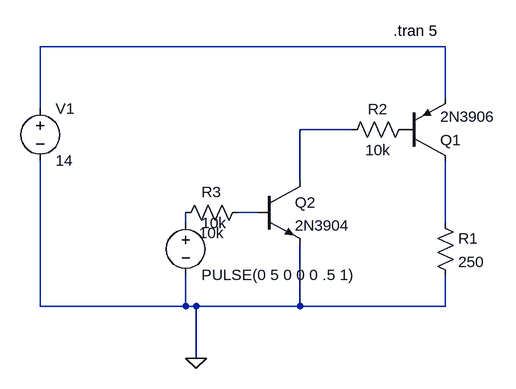
[diagram p0: schematic High side Switch 2BJT.asc]
High side Switch 2BJT.asc, the LTspice schematic file:
Version 4.1
SHEET 1 880 680
WIRE 288 64 -336 64
WIRE 288 144 288 64
WIRE -336 160 -336 64
WIRE 144 192 64 192
WIRE 64 272 64 192
WIRE 0 320 -32 320
WIRE -112 336 -112 320
WIRE 288 336 288 240
WIRE -336 464 -336 240
WIRE -112 464 -112 416
WIRE -112 464 -336 464
WIRE -96 464 -112 464
WIRE 64 464 64 368
WIRE 64 464 -96 464
WIRE 288 464 288 416
WIRE 288 464 64 464
WIRE -96 544 -96 464
FLAG -96 544 0
SYMBOL voltage -336 144 R0
WINDOW 123 0 0 Left 0
WINDOW 39 0 0 Left 0
SYMATTR InstName V1
SYMATTR Value 14
SYMBOL res 272 320 R0
SYMATTR InstName R1
SYMATTR Value 250
SYMBOL voltage -112 320 R0
WINDOW 123 0 0 Left 0
WINDOW 39 0 0 Left 0
SYMATTR InstName 10k
SYMATTR Value PULSE(0 5 0 0 0 .5 1)
SYMBOL pnp 224 240 M180
SYMATTR InstName Q1
SYMATTR Value 2N3906
SYMBOL npn 0 272 R0
SYMATTR InstName Q2
SYMATTR Value 2N3904
SYMBOL res 240 176 R90
WINDOW 0 0 56 VBottom 2
WINDOW 3 32 56 VTop 2
SYMATTR InstName R2
SYMATTR Value 10k
SYMBOL res -16 304 R90
WINDOW 0 0 56 VBottom 2
WINDOW 3 32 56 VTop 2
SYMATTR InstName R3
SYMATTR Value 10k
TEXT 208 40 Left 2 !.tran 5

The netlist it stands for:
* High side Switch 2BJT.asc
V1 N001 0 14
R1 N005 0 250
V§10k N004 0 PULSE(0 5 0 0 0 .5 1)
Q1 N005 P001 N001 0 2N3906
Q2 N002 N003 0 0 2N3904
R2 P001 N002 10k
R3 N003 N004 10k
.model NPN NPN
.model PNP PNP
.lib standard.bjt
.tran 5
.backanno
.end